# Altium schematic sheet poweramp_phase_splitter.SchDoc: Phase Spliter Ultra Bassman
size A4; Date: 22/02/2014; DrawnBy: Eduardo Marques; Engineer: Eduardo Marques; DocumentNumber: 4; DocumentName: Bassman PhaseSplitter
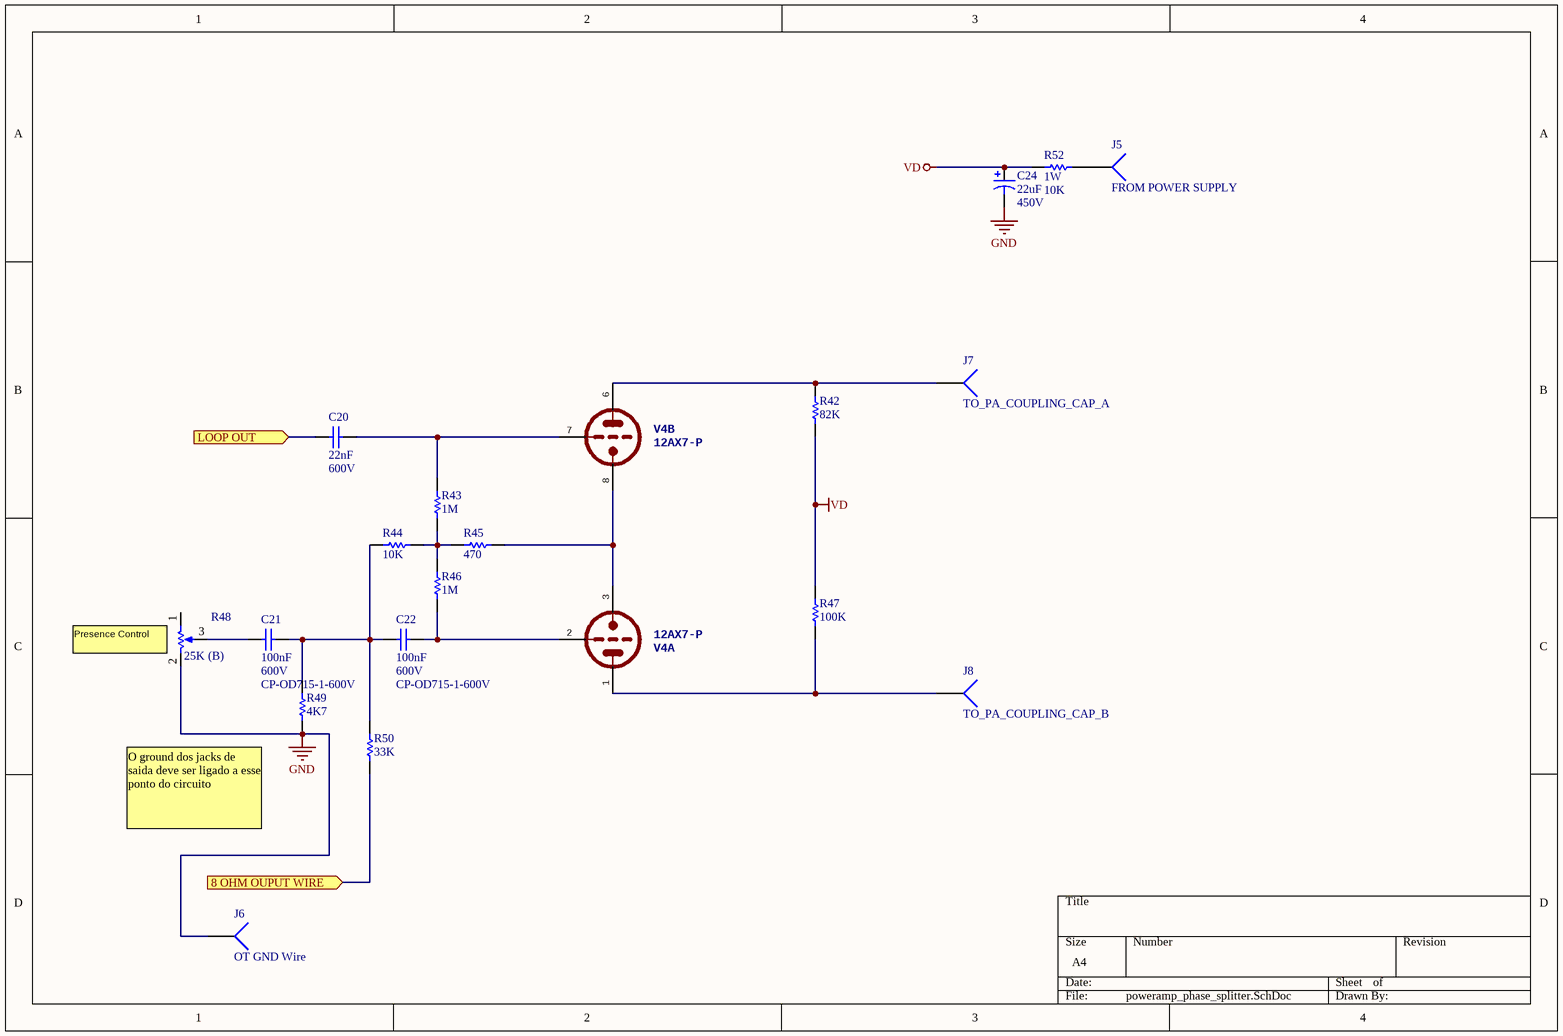
[diagram p0: poweramp_phase_splitter.SchDoc]

## Parts
C20  value 22nF  Voltage: 600V  [ORANGE-DROP-22nF-600V]  (hidden comment: Orange Drop Capacitor)
C21  value 100nF  Voltage: 600V  TUBEDEPOT_SN: CP-OD715-1-600V  [ORANGE-DROP-100nF-600V]  (hidden comment: Orange Drop Capacitor)
C22  value 100nF  Voltage: 600V  TUBEDEPOT_SN: CP-OD715-1-600V  [ORANGE-DROP-100nF-600V]  (hidden comment: Orange Drop Capacitor)
C24  value 22uF  Voltage: 450V  [RAD-POL-7.6-15]  (hidden comment: Cap Pol Rad)
J5  FROM POWER SUPPLY  [PIN1]
J6  OT GND Wire  [PIN1]
J7  TO_PA_COUPLING_CAP_A  [PIN1]
J8  TO_PA_COUPLING_CAP_B  [PIN1]
R42  value 82K  [AXIAL-0.6]  (hidden comment: Metal Film Resistor 1/2W)
R43  value 1M  [AXIAL-0.6]  (hidden comment: Metal Film Resistor 1/2W)
R44  value 10K  [AXIAL-0.6]  (hidden comment: Metal Film Resistor 1/2W)
R45  value 470  [AXIAL-0.6]  (hidden comment: Metal Film Resistor 1/2W)
R46  value 1M  [AXIAL-0.6]  (hidden comment: Metal Film Resistor 1/2W)
R47  value 100K  [AXIAL-0.6]  (hidden comment: Metal Film Resistor 1/2W)
R48  value 25K  TYPE: (B)  [pot_alpha - 2.54mm]  (hidden comment: ALPHA Potentiometer)
R49  value 4K7  [AXIAL-0.6]  (hidden comment: Metal Film Resistor 1/2W)
R50  value 33K  [AXIAL-0.6]  (hidden comment: Metal Film Resistor 1/2W)
R52  value 10K  Power: 1W  [AXIAL-0.6]  (hidden comment: Metal Film Resistor 1W)
V4  12AX7-P  [NOVAL]  (parts A,B of 3)

## Ports
8 OHM OUPUT WIRE (in), LOOP OUT (in)

## Nets
GND: C24.2 J6.1 R48.2(BOT) R49.1
VD: C24.1 R42.2 R47.1 R52.2
8 OHM OUPUT WIRE: R50.1 ; port 8 OHM OUPUT WIRE
LOOP OUT: C20.1 ; port LOOP OUT
NetC20_2: C20.2 R43.1 V4.7(TG)
NetC21_1: C21.1 R48.3(TAP)
NetC21_2: C21.2 C22.1 R44.2 R49.2 R50.2
NetC22_2: C22.2 R46.2 V4.2(TG)
NetJ5_1: J5.1 R52.1
NetJ7_1: J7.1 R42.1 V4.6(TA)
NetJ8_1: J8.1 R47.2 V4.1(TA)
NetR43_2: R43.2 R44.1 R45.2 R46.1
NetR45_1: R45.1 V4.3(TK) V4.8(TK)

Not connected (* = marked no-connect by the designer): R48 1(TOP)

## Notes on the sheet
- (near R48) Presence Control
- (near R49) O ground dos jacks de saida deve ser ligado a esse ponto do circuito

## Library data of the parts
C20 = Cap-Orange-DROP-22nF-600V: Capacitor; ManufacturerPartNumber: 715P22356KD3; Published: 23-April-2014; LatestRevisionDate: 23-April-2014; LatestRevisionNote: Creating the document; PackageReference: Orange Drop; Publisher: Linda HB Amplifiers; PackageDescription: Radial Cap, Thru-Hole; 2 Leads; 9.75mm Pin Spacing
C21 C22 = Cap-Orange-DROP-100nF-600V: Capacitor; ManufacturerPartNumber: 715P10496L; Published: 8-Jun-2000; LatestRevisionDate: 17-Jul-2002; LatestRevisionNote: Re-released for DXP Platform.; PackageReference: RAD-0.3; Publisher: Altium Limited; PackageDescription: Radial Cap, Thru-Hole; 2 Leads; 0.3 in Pin Spacing
C24 = Cap Pol Rad: Polarized Capacitor (Axial); Published: 8-Jun-2000; LatestRevisionDate: 17-Jul-2002; LatestRevisionNote: Re-released for DXP Platform.; PackageReference: POLAR0.8; Publisher: Altium Limited; PackageDescription: Polarized Capacitor; 2 Leads
J5 J7 J8 = Socket: LatestRevisionDate: 17-Jul-2002; LatestRevisionNote: Re-released for DXP Platform.; Publisher: Altium Limited
J6 = Socket: FromOTGroundWire; LatestRevisionDate: 17-Jul-2002; LatestRevisionNote: Re-released for DXP Platform.; Publisher: Altium Limited
R42-R47 R49 R50 = Res Metal Film 1/2W: Semiconductor Resistor; Published: 8-Jun-2000; LatestRevisionDate: 17-Jul-2002; LatestRevisionNote: 12-Fev-2014; PackageReference: AXIAL-0.6; Publisher: Whitesheep Amps; PackageDescription: Axial Device, Thru-Hole; 2 Leads; 0.5 in Pin Spacing; Power: 1/2W
R48 = alpha-pot: Potentiometer; Sim Note: Enter the Resistance value and the set point into parameter fields.; Set Position: 0.5; Published: 8-Jun-2000; LatestRevisionDate: 17-Jul-2002; LatestRevisionNote: Re-released for DXP Platform.; PackageReference: VR5; Publisher: Altium Limited; PackageDescription: Variable Resistor, Thru-Hole; 3 Leads
R52 = Res Wire Wound 1W: Semiconductor Resistor; Published: 8-Jun-2000; LatestRevisionDate: 29-Mar-2014; LatestRevisionNote: 19-Mar-2014; PackageReference: AXIAL-0.5; Publisher: Linda Hand Buit Amplifiers; PackageDescription: Axial Device, Thru-Hole; 2 Leads; 0.5 in Pin Spacing